# EAGLE design asserv v2 (EAGLE 9.3.0)
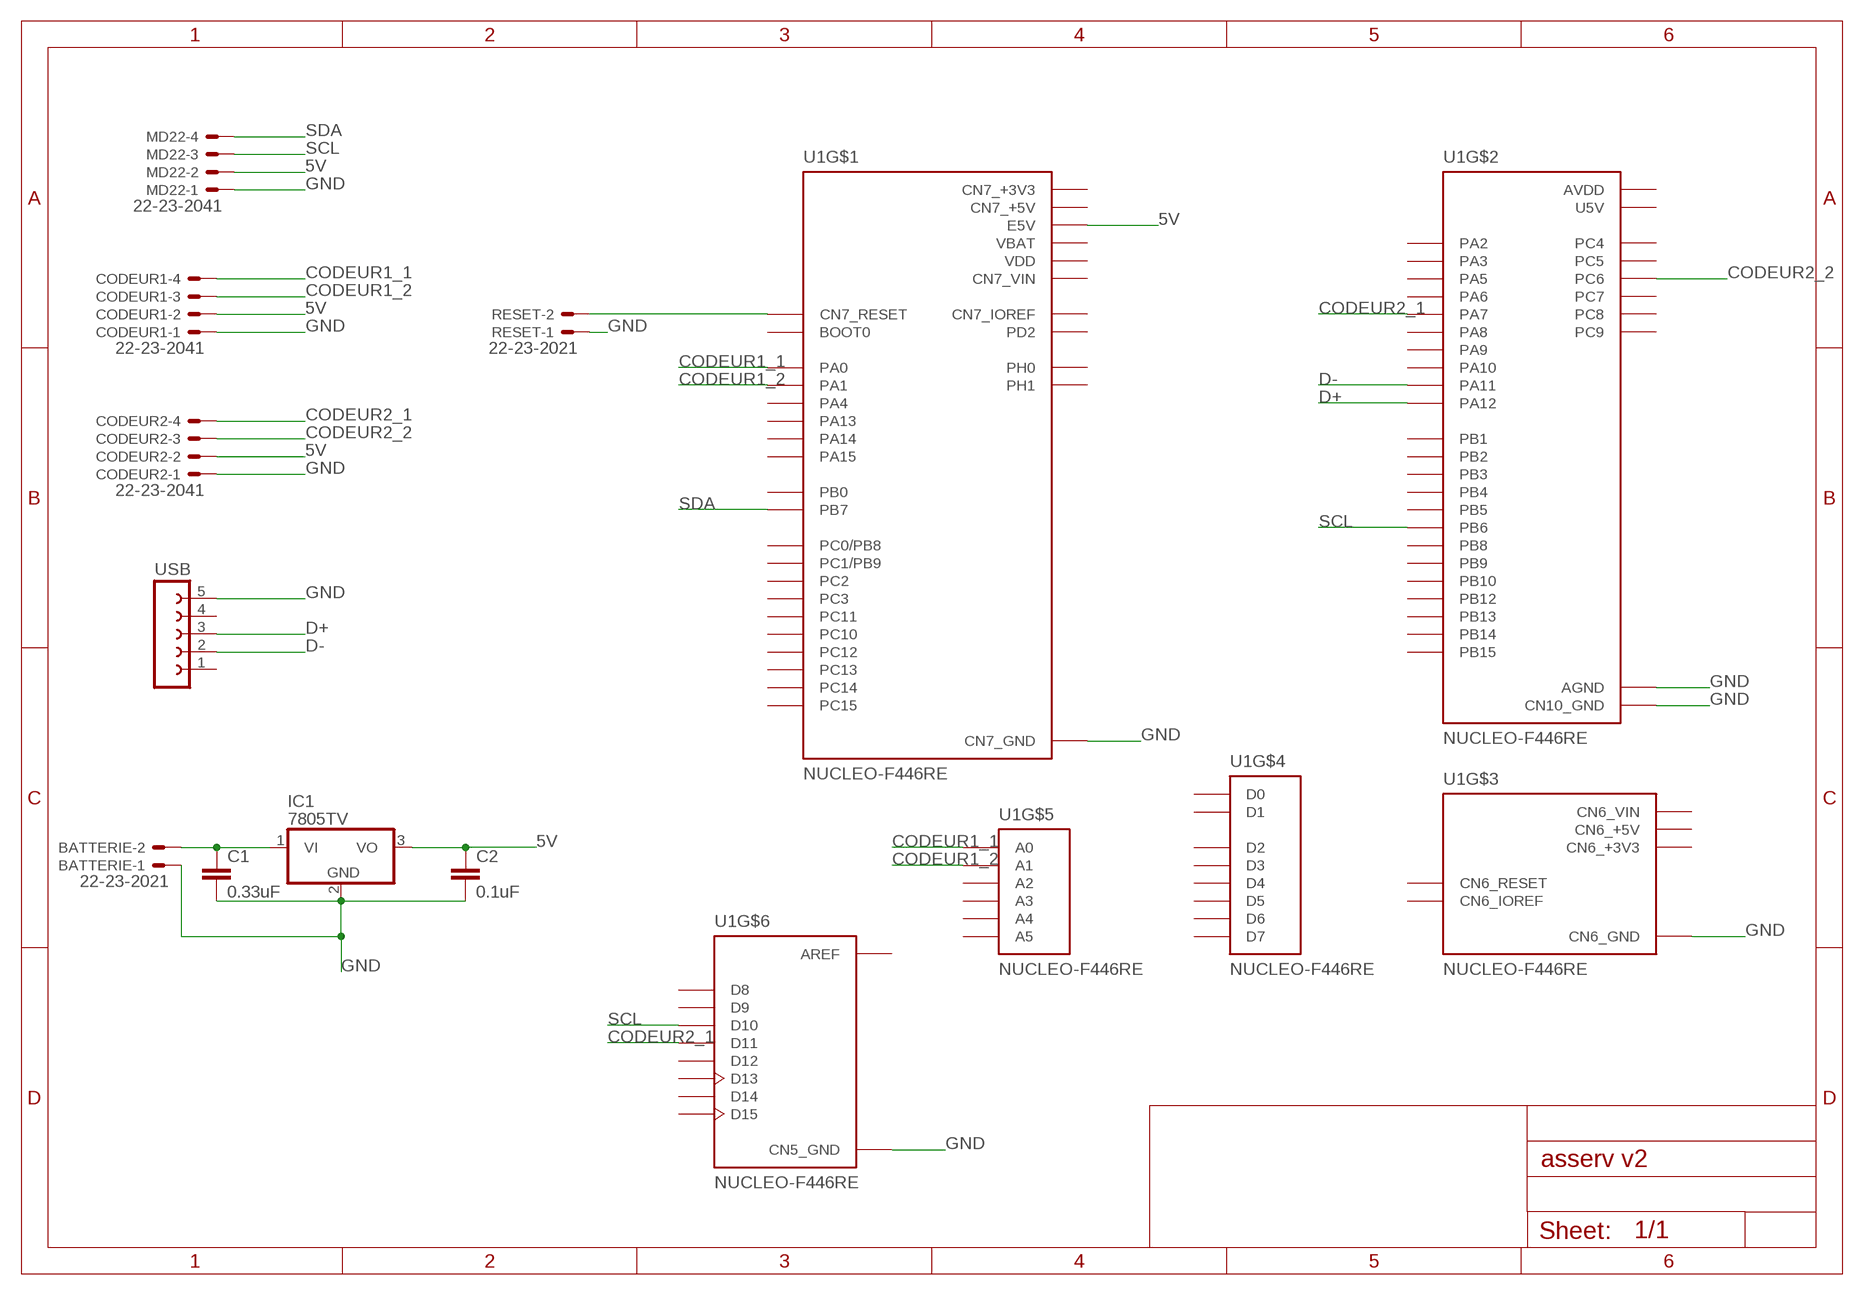
[diagram p0: schematic, sheet 1]

## Parts
BATTERIE  22-23-2021  [22-23-2021]
C1  0.33uF  C5/2.5  [C5B2.5]
C2  0.1uF  C5/2.5  [C5B2.5]
CODEUR1  22-23-2041  [22-23-2041]
CODEUR2  22-23-2041  [22-23-2041]
IC1  7805TV  [TO220V]
MD22  22-23-2041  [22-23-2041]
RESET  22-23-2021  [22-23-2021]
U1  NUCLEO-F446RE  [MODULE_NUCLEO-F446RE]
USB  FE05-1  [FE05-1]

## Nets
5V: C2.1 CODEUR1.2 CODEUR2.2 IC1.3(VO) MD22.2 U1.CN7_6(E5V)
CODEUR1_1: CODEUR1.4 U1.CN7_28(PA0) U1.CN8_1(A0)
CODEUR1_2: CODEUR1.3 U1.CN7_30(PA1) U1.CN8_2(A1)
CODEUR2_1: CODEUR2.4 U1.CN5_4(D11) U1.CN10_15(PA7)
CODEUR2_2: CODEUR2.3 U1.CN10_4(PC6)
D+: U1.CN10_12(PA12) USB.3
D-: U1.CN10_14(PA11) USB.2
GND: BATTERIE.1 C1.2 C2.2 CODEUR1.1 CODEUR2.1 IC1.2(GND) MD22.1 RESET.1 U1.CN5_7(CN5_GND) U1.CN6_6(CN6_GND) U1.CN6_7(CN6_GND) U1.CN7_8(CN7_GND) U1.CN7_19(CN7_GND) U1.CN7_20(CN7_GND) U1.CN7_22(CN7_GND) U1.CN10_9(CN10_GND) U1.CN10_20(CN10_GND) U1.CN10_32(AGND) USB.5
N$1: BATTERIE.2 C1.1 IC1.1(VI)
N$4: RESET.2 U1.CN7_14(CN7_RESET)
SCL: MD22.3 U1.CN5_3(D10) U1.CN10_17(PB6)
SDA: MD22.4 U1.CN7_21(PB7)
Unconnected: U1.CN5_1(D8) U1.CN5_2(D9) U1.CN5_5(D12) U1.CN5_6(D13) U1.CN5_9(D14) U1.CN5_10(D15) U1.CN6_2(CN6_IOREF) U1.CN6_3(CN6_RESET) U1.CN7_1(PC10) U1.CN7_2(PC11) U1.CN7_3(PC12) U1.CN7_4(PD2) U1.CN7_7(BOOT0) U1.CN7_12(CN7_IOREF) U1.CN7_13(PA13) U1.CN7_15(PA14) U1.CN7_17(PA15) U1.CN7_23(PC13) U1.CN7_25(PC14) U1.CN7_27(PC15) U1.CN7_29(PH0) U1.CN7_31(PH1) U1.CN7_32(PA4) U1.CN7_34(PB0) U1.CN7_35(PC2) U1.CN7_36(PC1/PB9) U1.CN7_37(PC3) U1.CN7_38(PC0/PB8) U1.CN8_3(A2) U1.CN8_4(A3) U1.CN8_5(A4) U1.CN8_6(A5) U1.CN9_1(D0) U1.CN9_2(D1) U1.CN9_3(D2) U1.CN9_4(D3) U1.CN9_5(D4) U1.CN9_6(D5) U1.CN9_7(D6) U1.CN9_8(D7) U1.CN10_1(PC9) U1.CN10_2(PC8) U1.CN10_3(PB8) U1.CN10_5(PB9) U1.CN10_6(PC5) U1.CN10_11(PA5) U1.CN10_13(PA6) U1.CN10_16(PB12) U1.CN10_19(PC7) U1.CN10_21(PA9) U1.CN10_22(PB2) U1.CN10_23(PA8) U1.CN10_24(PB1) U1.CN10_25(PB10) U1.CN10_26(PB15) U1.CN10_27(PB4) U1.CN10_28(PB14) U1.CN10_29(PB5) U1.CN10_30(PB13) U1.CN10_31(PB3) U1.CN10_33(PA10) U1.CN10_34(PC4) U1.CN10_35(PA2) U1.CN10_37(PA3) USB.1 USB.4

## Power pins joined to a net without a drawn wire
AREF: U1.CN5_8(AREF)
AVDD: U1.CN10_7(AVDD)
CN6_+3V3: U1.CN6_4(CN6_+3V3)
CN6_+5V: U1.CN6_5(CN6_+5V)
CN6_VIN: U1.CN6_8(CN6_VIN)
CN7_+3V3: U1.CN7_16(CN7_+3V3)
CN7_+5V: U1.CN7_18(CN7_+5V)
CN7_VIN: U1.CN7_24(CN7_VIN)
U5V: U1.CN10_8(U5V)
VBAT: U1.CN7_33(VBAT)
VDD: U1.CN7_5(VDD)

## Library data of the parts
BATTERIE RESET = con-molex:22-23-2021: .100" (2.54mm) Center Header - 2 Pin; MF: MOLEX; MPN: 22-23-2021; OC_FARNELL: 1462926; OC_NEWARK: 25C3832
C1 C2 = capacitor-wima:C: CAPACITOR naming: grid - package width
CODEUR1 CODEUR2 MD22 = con-molex:22-23-2041: .100" (2.54mm) Center Header - 4 Pin; MF: MOLEX; MPN: 22-23-2041; OC_FARNELL: 1462920; OC_NEWARK: 38C0355
IC1 = linear:78*: Positive VOLTAGE REGULATOR Source: http://cache.national.com/ds/LM/LM78L05.pdf http://www.fairchildsemi.com/ds/LM/LM7805.pdf
U1 = NUCLEO-F446RE:NUCLEO-F446RE: STM32 Nucleo-64 development board with STM32F446RET6 MCU, supports Arduino and ST morpho connectivity; AVAILABILITY: Unavailable; DESCRIPTION: STM32F446RE, mbed-Enabled Development Nucleo-64 STM32F4 ARM® Cortex®-M4 MCU 32-Bit Embedded Evaluation Board; MF: STMICROELECTRONICS; MP: NUCLEO-F446RE; MPN: NUCLEO-F446RE; OC_FARNELL: 2491978; PACKAGE: None; PRICE: None; SPICEPREFIX: X
USB = con-lsta:FE05-1: FEMALE HEADER; OC_FARNELL: unknown; OC_NEWARK: unknown

## Board
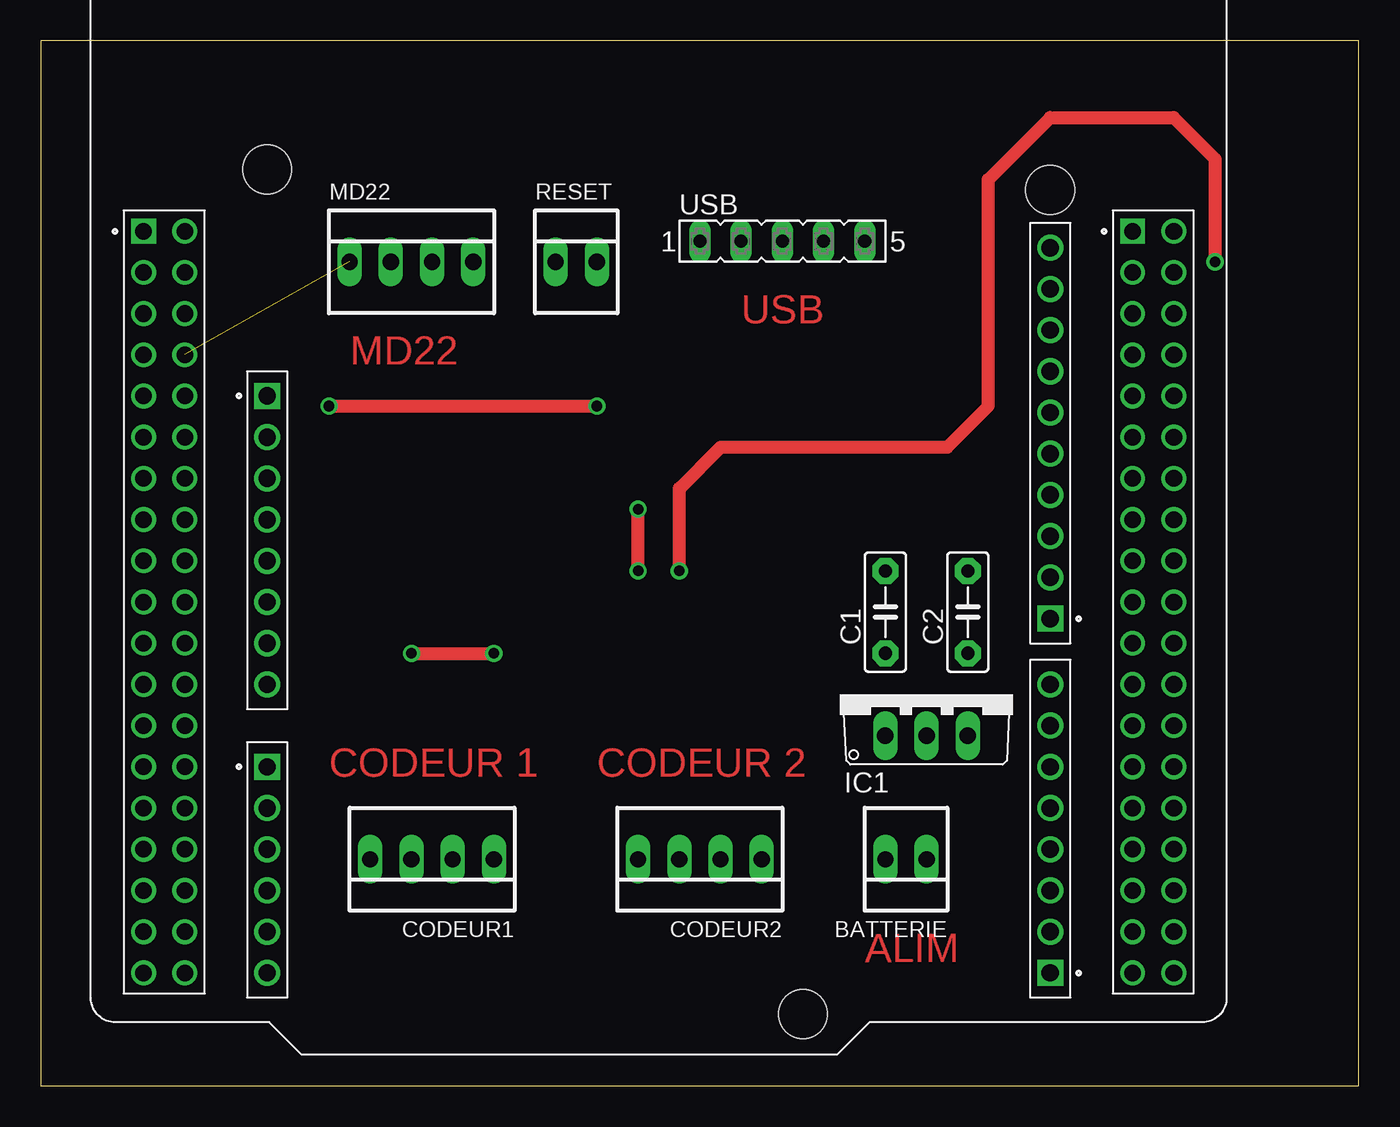
[diagram p1: board, top side]
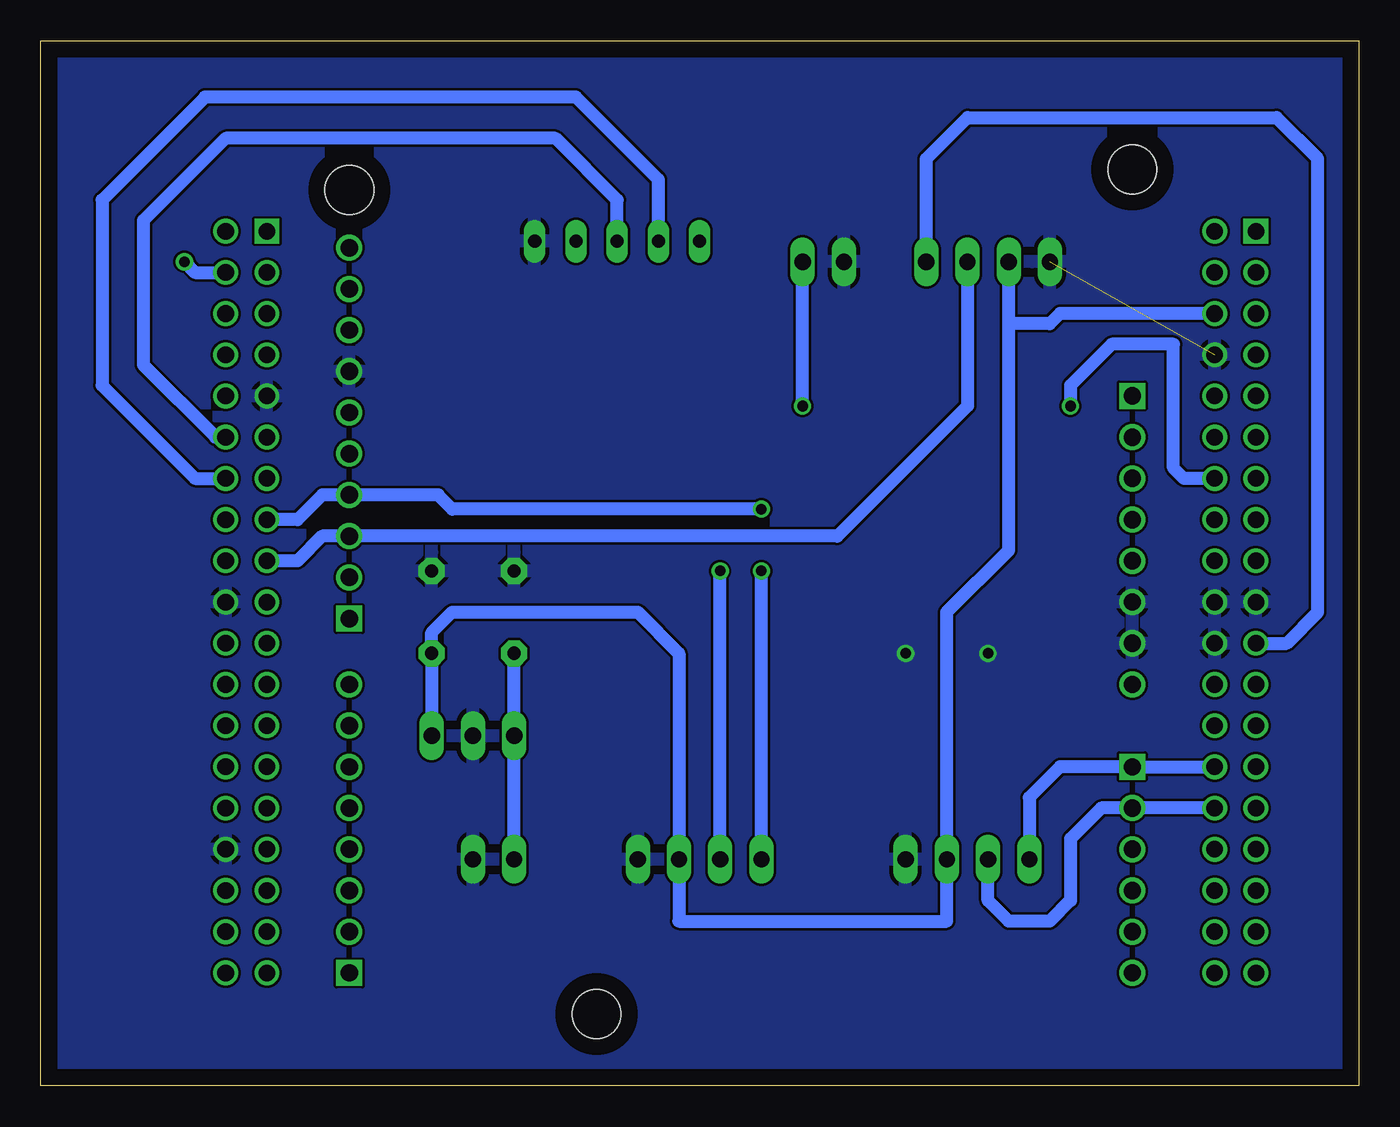
[diagram p2: board, bottom side, seen from below]

Size 81.26 x 64.44 mm. Coordinates in mm from the lower left corner, seen from the top.
Outline: 0,0 81.26,0 81.26,64.44 0,64.44 0,0
Copper layers (1*16): Top 0.035mm / dielectric 1.5mm / Bottom 0.035mm
Design rules "default": minimum track width 6mil, minimum drill 0.35mm, track to track 6mil, track to pad 6mil, pad to pad 6mil, via to via 6mil, smd to smd 6mil, copper to edge 40mil, drill to drill 6mil, minimum pad ring 10mil, minimum via ring 8mil, stop-mask expansion 4mil, vias tented up to drill 0mil, thermal gap 10mil

### Footprints (pad centres in the part's own frame; a part is rotated, then mirrored left to right if it is on the bottom)
22-23-2021 = drill 1 long: 1 -1.27,0; 2 1.27,0
C5B2.5 = drill 0.813 pad 1.6 octagon: 1 -2.54,0; 2 2.54,0
22-23-2041 = drill 1 long: 1 -3.81,0; 2 -1.27,0; 3 1.27,0; 4 3.81,0
TO220V = drill 1.016 long: 1 -2.54,-2.54; 2 0,-2.54; 3 2.54,-2.54
MODULE_NUCLEO-F446RE = drill 1.07 square: CN5_1 24.13,-14.37; CN6_1 -24.13,-0.65; CN8_1 -24.13,-23.51; CN9_1 24.13,-36.21 | drill 1.07: CN5_2 24.13,-11.83; CN5_3 24.13,-9.29; CN5_4 24.13,-6.75; CN5_5 24.13,-4.21; CN5_6 24.13,-1.67; CN5_7 24.13,0.87; CN5_8 24.13,3.41; CN5_9 24.13,5.95; CN5_10 24.13,8.49; CN6_2 -24.13,-3.19; CN6_3 -24.13,-5.73; CN6_4 -24.13,-8.27; CN6_5 -24.13,-10.81; CN6_6 -24.13,-13.35; CN6_7 -24.13,-15.89; CN6_8 -24.13,-18.43; CN8_2 -24.13,-26.05; CN8_3 -24.13,-28.59; CN8_4 -24.13,-31.13; CN8_5 -24.13,-33.67; CN8_6 -24.13,-36.21; CN9_2 24.13,-33.67; CN9_3 24.13,-31.13; CN9_4 24.13,-28.59; CN9_5 24.13,-26.05; CN9_6 24.13,-23.51; CN9_7 24.13,-20.97; CN9_8 24.13,-18.43 | drill 1.02 square: CN7_1 -31.75,9.51; CN10_1 29.21,9.51 | drill 1.02: CN7_2 -29.21,9.51; CN7_3 -31.75,6.97; CN7_4 -29.21,6.97; CN7_5 -31.75,4.43; CN7_6 -29.21,4.43; CN7_7 -31.75,1.89; CN7_8 -29.21,1.89; CN7_9 -31.75,-0.65; CN7_10 -29.21,-0.65; CN7_11 -31.75,-3.19; CN7_12 -29.21,-3.19; CN7_13 -31.75,-5.73; CN7_14 -29.21,-5.73; CN7_15 -31.75,-8.27; CN7_16 -29.21,-8.27; CN7_17 -31.75,-10.81; CN7_18 -29.21,-10.81; CN7_19 -31.75,-13.35; CN7_20 -29.21,-13.35; CN7_21 -31.75,-15.89; CN7_22 -29.21,-15.89; CN7_23 -31.75,-18.43; CN7_24 -29.21,-18.43; CN7_25 -31.75,-20.97; CN7_26 -29.21,-20.97; CN7_27 -31.75,-23.51; CN7_28 -29.21,-23.51; CN7_29 -31.75,-26.05; CN7_30 -29.21,-26.05; CN7_31 -31.75,-28.59; CN7_32 -29.21,-28.59; CN7_33 -31.75,-31.13; CN7_34 -29.21,-31.13; CN7_35 -31.75,-33.67; CN7_36 -29.21,-33.67; CN7_37 -31.75,-36.21; CN7_38 -29.21,-36.21; CN10_2 31.75,9.51; CN10_3 29.21,6.97; CN10_4 31.75,6.97; CN10_5 29.21,4.43; CN10_6 31.75,4.43; CN10_7 29.21,1.89; CN10_8 31.75,1.89; CN10_9 29.21,-0.65; CN10_10 31.75,-0.65; CN10_11 29.21,-3.19; CN10_12 31.75,-3.19; CN10_13 29.21,-5.73; CN10_14 31.75,-5.73; CN10_15 29.21,-8.27; CN10_16 31.75,-8.27; CN10_17 29.21,-10.81; CN10_18 31.75,-10.81; CN10_19 29.21,-13.35; CN10_20 31.75,-13.35; CN10_21 29.21,-15.89; CN10_22 31.75,-15.89; CN10_23 29.21,-18.43; CN10_24 31.75,-18.43; CN10_25 29.21,-20.97; CN10_26 31.75,-20.97; CN10_27 29.21,-23.51; CN10_28 31.75,-23.51; CN10_29 29.21,-26.05; CN10_30 31.75,-26.05; CN10_31 29.21,-28.59; CN10_32 31.75,-28.59; CN10_33 29.21,-31.13; CN10_34 31.75,-31.13; CN10_35 29.21,-33.67; CN10_36 31.75,-33.67; CN10_37 29.21,-36.21; CN10_38 31.75,-36.21 | hole 3: 8.89,-38.75; 24.13,12.05; -24.13,13.32
FE05-1 = drill 0.813 long: 1 -5.08,0; 2 -2.54,0; 3 0,0; 4 2.54,0; 5 5.08,0

### Placement (x,y rotation side)
BATTERIE  53.34,13.97 180 top
C1  52.07,29.21 90 top
C2  57.15,29.21 90 top
CODEUR1  24.13,13.97 180 top
CODEUR2  40.64,13.97 180 top
IC1  54.61,24.13 0 top
MD22  22.86,50.8 0 top
RESET  33.02,50.8 0 top
U1  38.1,43.18 0 top
USB  45.72,52.07 0 top

### Tracks (layer width: path | path; a pad name or v marks a point on that pad's centre or on a via)
5V
  Bottom 0.813: 21.59,46.99 21.59,33.02 25.4,29.21 CODEUR1.2 25.4,10.16 41.91,10.16 CODEUR2.2 41.91,26.67 44.45,29.21 55.88,29.21 57.15,27.94 C2.1 IC1.3 | 21.59,46.99 MD22.2 | U1.CN7_6 12.05,47.61 18.43,47.61 19.05,46.99 21.59,46.99
CODEUR1_1
  Bottom 0.813: CODEUR1.4 20.32,17.78 18.43,19.67 U1.CN8_1 U1.CN7_28
CODEUR1_2
  Bottom 0.813: U1.CN7_30 U1.CN8_2 15.89,17.13 17.78,15.24 17.78,11.43 19.05,10.16 21.59,10.16 22.86,11.43 CODEUR1.3
CODEUR2_1  (via drill 0.65)
  Top 0.813: v36.83,31.75 v36.83,35.56
  Bottom 0.813: U1.CN10_15 65.42,34.91 63.9,36.43 U1.CN5_4 56.75,36.43 55.88,35.56 v36.83,35.56 | CODEUR2.4 v36.83,31.75
CODEUR2_2  (via drill 0.65)
  Top 0.813: v39.37,31.75 39.37,36.83 41.91,39.37 55.88,39.37 58.42,41.91 58.42,55.88 62.23,59.69 69.85,59.69 72.39,57.15 v72.39,50.8
  Bottom 0.813: CODEUR2.3 v39.37,31.75 | v72.39,50.8 71.74,50.15 U1.CN10_4
D+
  Bottom 0.813: USB.3 45.72,54.61 49.53,58.42 69.85,58.42 74.93,53.34 74.93,44.45 70.47,39.99 U1.CN10_12
D-
  Bottom 0.813: USB.2 43.18,55.88 48.26,60.96 71.12,60.96 77.47,54.61 77.47,43.18 71.74,37.45 U1.CN10_14
GND  (via drill 0.65)  (1 unrouted)
  Top 0.813: v22.86,26.67 v27.94,26.67
  pour Bottom: 80.01,63.5 80.01,1.27 1.27,1.27 1.27,62.23 1.27,63.5
N$1
  Bottom 0.813: BATTERIE.2 IC1.1 C1.1
N$4  (via drill 0.65)
  Top 0.813: v17.78,41.91 v34.29,41.91
  Bottom 0.813: U1.CN7_14 10.78,37.45 11.43,38.1 11.43,45.72 15.24,45.72 17.78,43.18 v17.78,41.91 | v34.29,41.91 RESET.2
SCL
  Bottom 0.813: MD22.3 24.13,41.91 32.15,33.89 U1.CN5_3 63.9,33.89 65.42,32.37 U1.CN10_17
SDA
  Bottom 0.813: MD22.4 26.67,57.15 24.13,59.69 5.08,59.69 2.54,57.15 2.54,29.21 4.46,27.29 U1.CN7_21

### Text on the board
Top: USB | MD22 | CODEUR 1 | CODEUR 2 | ALIM